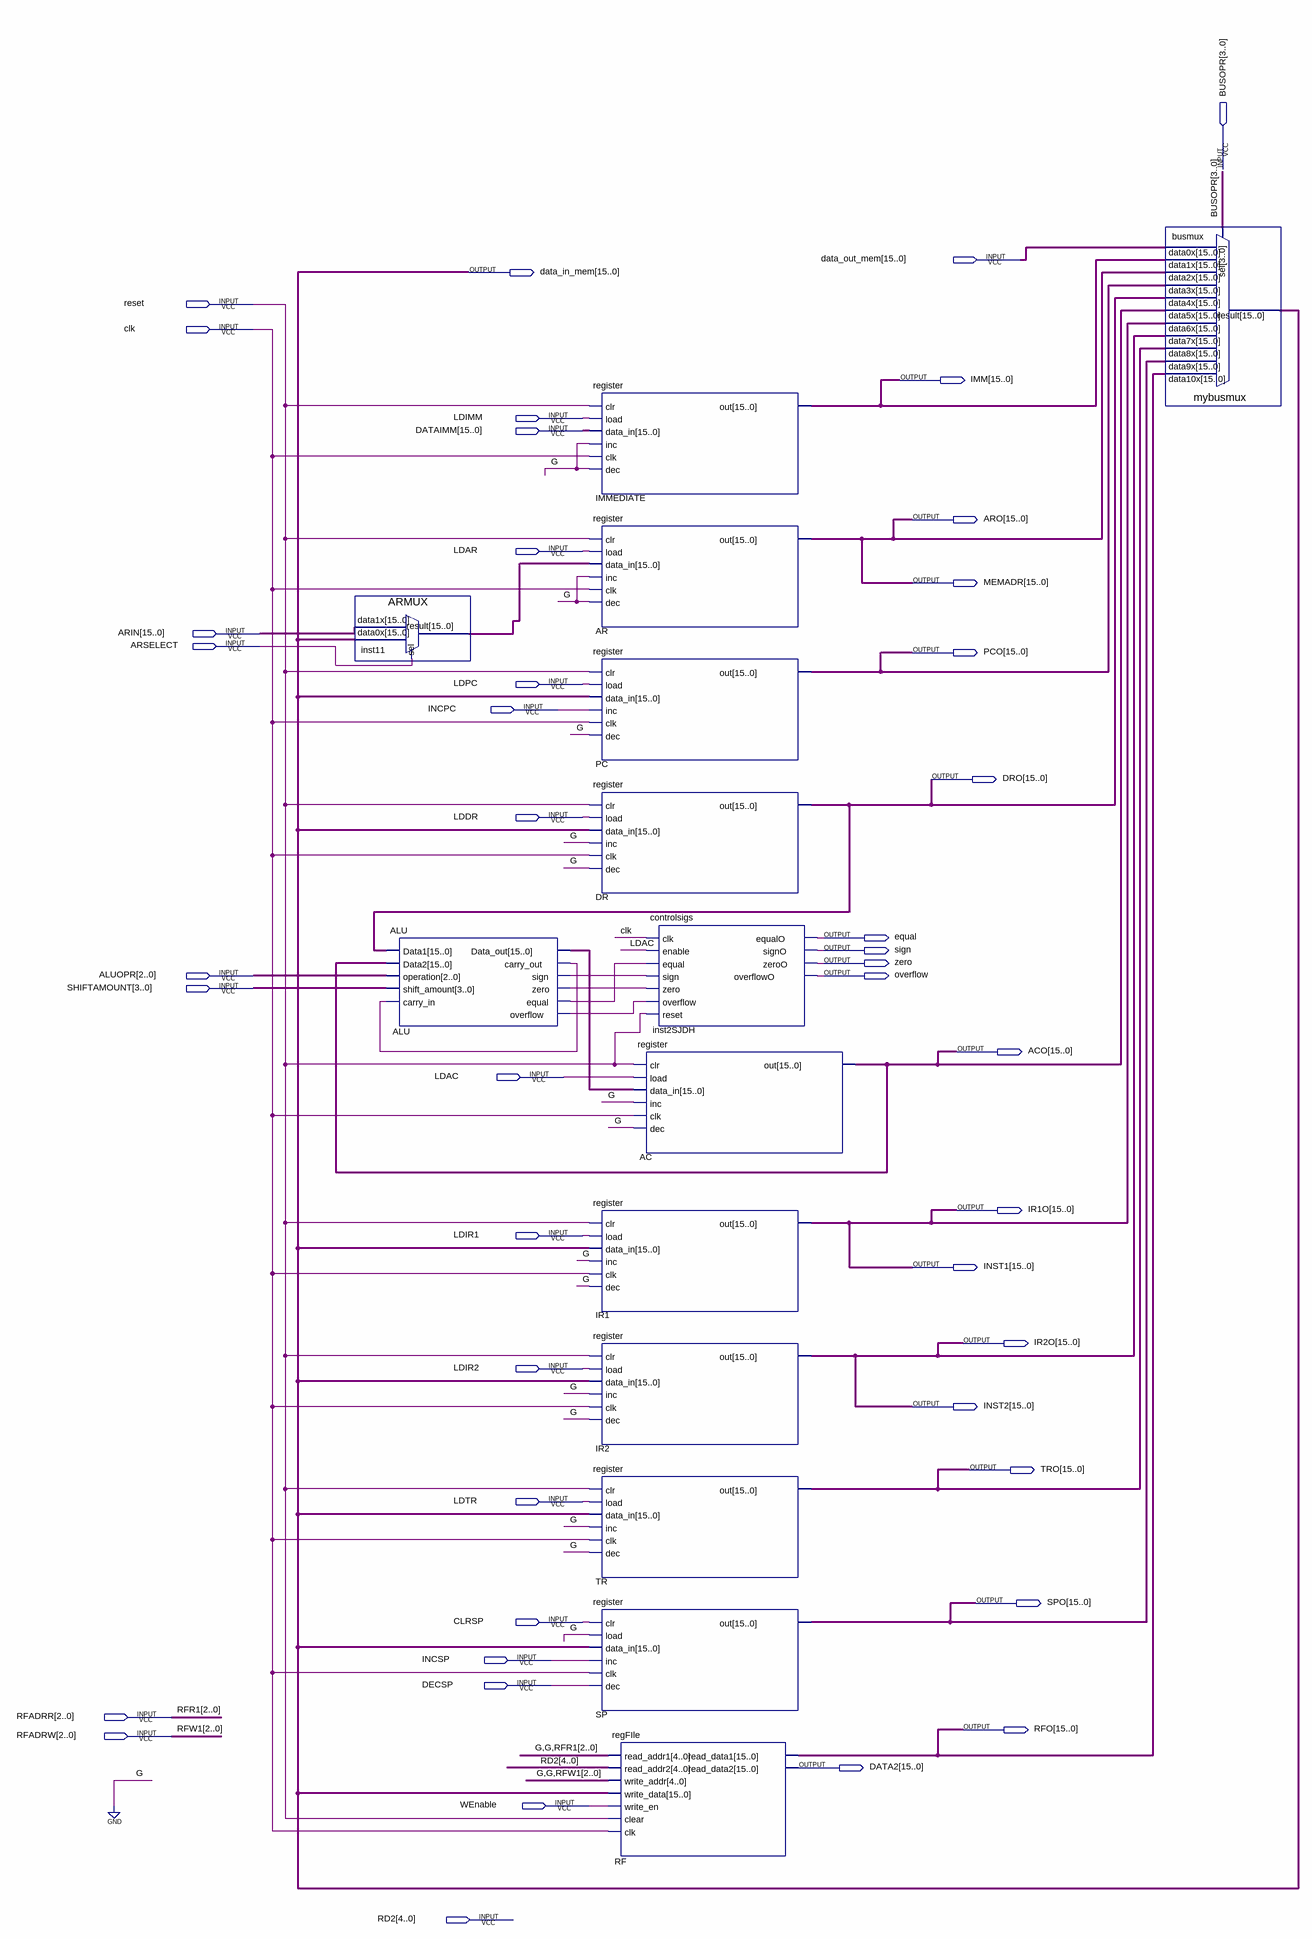
[diagram p0: schematic sheet]
// Quartus schematic DATAPATH.bdf as structural Verilog: 14 symbols, 44 pins
module DATAPATH (
  input  [3:0] BUSOPR,
  input  [15:0] data_out_mem,
  input  reset,
  input  clk,
  input  LDIMM,
  input  [15:0] DATAIMM,
  input  LDAR,
  input  [15:0] ARIN,
  input  ARSELECT,
  input  LDPC,
  input  INCPC,
  input  LDDR,
  input  [2:0] ALUOPR,
  input  [3:0] SHIFTAMOUNT,
  input  LDAC,
  input  LDIR1,
  input  LDIR2,
  input  LDTR,
  input  CLRSP,
  input  INCSP,
  input  DECSP,
  input  [2:0] RFADRR,
  input  [2:0] RFADRW,
  input  WEnable,
  input  [4:0] RD2,
  output [15:0] data_in_mem,
  output [15:0] IMM,
  output [15:0] ARO,
  output [15:0] MEMADR,
  output [15:0] PCO,
  output [15:0] DRO,
  output equal,
  output sign,
  output zero,
  output overflow,
  output [15:0] ACO,
  output [15:0] IR1O,
  output [15:0] INST1,
  output [15:0] IR2O,
  output [15:0] INST2,
  output [15:0] TRO,
  output [15:0] SPO,
  output [15:0] RFO,
  output [15:0] DATA2
);

  wire ALU_carry_out, ALU_equal, ALU_overflow, ALU_sign, ALU_zero;
  wire [15:0] ALU_data_out, inst11_result;

  ARMUX inst11 (.data1x(ARIN), .data0x(data_in_mem), .sel(ARSELECT), .result(inst11_result));
  ALU ALU (
    .Data1(DRO), .Data2(ACO), .operation(ALUOPR), .shift_amount(SHIFTAMOUNT), .carry_in(ALU_carry_out),
    .Data_out(ALU_data_out), .carry_out(ALU_carry_out), .sign(ALU_sign), .zero(ALU_zero), .equal(ALU_equal),
    .overflow(ALU_overflow));
  register IMMEDIATE (.clr(reset), .load(LDIMM), .data_in(DATAIMM), .inc(1'b0), .clk(clk), .dec(1'b0), .out(IMM));
  register AR (.clr(reset), .load(LDAR), .data_in(inst11_result), .inc(1'b0), .clk(clk), .dec(1'b0), .out(ARO));
  register PC (.clr(reset), .load(LDPC), .data_in(data_in_mem), .inc(INCPC), .clk(clk), .dec(1'b0), .out(PCO));
  register DR (.clr(reset), .load(LDDR), .data_in(data_in_mem), .inc(1'b0), .clk(clk), .dec(1'b0), .out(DRO));
  register IR1 (.clr(reset), .load(LDIR1), .data_in(data_in_mem), .inc(1'b0), .clk(clk), .dec(1'b0), .out(INST1));
  register IR2 (.clr(reset), .load(LDIR2), .data_in(data_in_mem), .inc(1'b0), .clk(clk), .dec(1'b0), .out(INST2));
  register TR (.clr(reset), .load(LDTR), .data_in(data_in_mem), .inc(1'b0), .clk(clk), .dec(1'b0), .out(TRO));
  register SP (.clr(CLRSP), .load(1'b0), .data_in(data_in_mem), .inc(INCSP), .clk(clk), .dec(DECSP), .out(SPO));
  controlsigs inst2SJDH (
    .clk(clk), .enable(LDAC), .equal(ALU_equal), .sign(ALU_sign), .zero(ALU_zero), .overflow(ALU_overflow),
    .reset(reset), .equalO(equal), .signO(sign), .zeroO(zero), .overflowO(overflow));
  register AC (.clr(reset), .load(LDAC), .data_in(ALU_data_out), .inc(1'b0), .clk(clk), .dec(1'b0), .out(ACO));
  regFIle RF (
    .read_addr1({2'b00, RFADRR}), .read_addr2(RD2), .write_addr({2'b00, RFADRW}), .write_data(data_in_mem),
    .write_en(WEnable), .clear(reset), .clk(clk), .read_data1(RFO), .read_data2(DATA2));
  mybusmux busmux (
    .data10x(RFO), .data9x(SPO), .data8x(TRO), .data7x(INST2), .data6x(INST1), .data5x(ACO), .data4x(DRO),
    .data3x(PCO), .data2x(ARO), .data1x(IMM), .data0x(data_out_mem), .sel(BUSOPR), .result(data_in_mem));

  assign IR1O = INST1;
  assign IR2O = INST2;
  assign MEMADR = ARO;

  // Other names for the same wires on the sheet: RFR1[2:0] = RFADRR; RFW1[2:0] = RFADRW
endmodule
